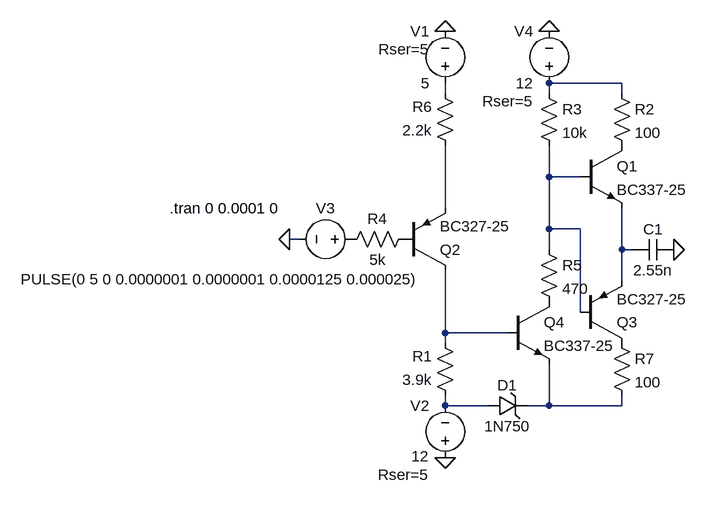
[diagram p0: schematic sender_push_pull.asc]
sender_push_pull.asc, the LTspice schematic file:
Version 4
SHEET 1 1076 692
WIRE 768 64 656 64
WIRE 496 80 496 64
WIRE 656 80 656 64
WIRE 768 80 768 64
WIRE 656 208 656 160
WIRE 704 208 656 208
WIRE 496 256 496 160
WIRE 656 288 656 208
WIRE 704 288 656 288
WIRE 272 304 256 304
WIRE 656 320 656 288
WIRE 768 320 768 256
WIRE 784 320 768 320
WIRE 768 368 768 320
WIRE 704 416 704 288
WIRE 496 448 496 352
WIRE 592 448 496 448
WIRE 496 464 496 448
WIRE 496 560 496 544
WIRE 560 560 496 560
WIRE 656 560 656 496
WIRE 656 560 624 560
WIRE 768 560 768 544
WIRE 768 560 656 560
FLAG 256 304 0
FLAG 496 640 0
FLAG 496 -16 0
FLAG 656 -16 0
FLAG 848 320 0
SYMBOL voltage 368 304 R90
WINDOW 0 -32 56 VBottom 2
WINDOW 3 46 215 VTop 2
WINDOW 123 0 0 Left 2
WINDOW 39 0 0 Left 2
SYMATTR InstName V3
SYMATTR Value PULSE(0 5 0 0.0000001 0.0000001 0.0000125 0.000025)
SYMBOL pnp 432 352 M180
SYMATTR InstName Q2
SYMATTR Value BC327-25
SYMBOL res 448 288 R90
WINDOW 0 0 56 VBottom 2
WINDOW 3 32 56 VTop 2
SYMATTR InstName R4
SYMATTR Value 5k
SYMBOL voltage 496 656 R180
WINDOW 0 24 96 Left 2
WINDOW 3 25 18 Left 2
WINDOW 123 0 0 Left 2
WINDOW 39 25 -10 Left 2
SYMATTR InstName V2
SYMATTR Value 12
SYMATTR SpiceLine Rser=5
SYMBOL res 512 560 R180
WINDOW 0 36 76 Left 2
WINDOW 3 36 40 Left 2
SYMATTR InstName R1
SYMATTR Value 3.9k
SYMBOL voltage 496 80 R180
WINDOW 0 24 96 Left 2
WINDOW 3 24 16 Left 2
WINDOW 123 0 0 Left 2
WINDOW 39 24 68 Left 2
SYMATTR InstName V1
SYMATTR Value 5
SYMATTR SpiceLine Rser=5
SYMBOL voltage 656 80 R180
WINDOW 0 24 96 Left 2
WINDOW 3 24 16 Left 2
WINDOW 123 0 0 Left 2
WINDOW 39 24 -12 Left 2
SYMATTR InstName V4
SYMATTR Value 12
SYMATTR SpiceLine Rser=5
SYMBOL cap 848 304 R90
WINDOW 0 0 32 VBottom 2
WINDOW 3 32 32 VTop 2
SYMATTR InstName C1
SYMATTR Value 2.55n
SYMBOL npn 704 160 R0
SYMATTR InstName Q1
SYMATTR Value BC337-25
SYMBOL res 752 64 R0
SYMATTR InstName R2
SYMATTR Value 100
SYMBOL res 640 64 R0
SYMATTR InstName R3
SYMATTR Value 10k
SYMBOL npn 592 400 R0
SYMATTR InstName Q4
SYMATTR Value BC337-25
SYMBOL res 640 304 R0
SYMATTR InstName R5
SYMATTR Value 470
SYMBOL res 512 176 R180
WINDOW 0 36 76 Left 2
WINDOW 3 36 40 Left 2
SYMATTR InstName R6
SYMATTR Value 2.2k
SYMBOL res 752 448 R0
SYMATTR InstName R7
SYMATTR Value 100
SYMBOL pnp 704 464 M180
SYMATTR InstName Q3
SYMATTR Value BC327-25
SYMBOL zener 560 576 R270
WINDOW 0 32 32 VTop 2
WINDOW 3 0 32 VBottom 2
SYMATTR InstName D1
SYMATTR Value 1N750
SYMATTR Description Diode
SYMATTR Type diode
TEXT 72 256 Left 2 !.tran 0 0.0001 0

The netlist it stands for:
* sender_push_pull.asc
V3 P001 0 PULSE(0 5 0 0.0000001 0.0000001 0.0000125 0.000025)
Q2 N006 P002 N004 0 BC327-25
R4 P002 P001 5k
V2 0 N007 12 Rser=5
R1 N007 N006 3.9k
V1 N002 0 5 Rser=5
V4 N001 0 12 Rser=5
C1 0 N005 2.55n
Q1 P003 N003 N005 0 BC337-25
R2 N001 P003 100
R3 N001 N003 10k
Q4 P004 N006 N008 0 BC337-25
R5 N003 P004 470
R6 N004 N002 2.2k
R7 P005 N008 100
Q3 P005 N003 N005 0 BC327-25
D1 N007 N008 1N750
.model D D
.lib standard.dio
.model NPN NPN
.model PNP PNP
.lib standard.bjt
.tran 0 0.0001 0
.backanno
.end